# EAGLE schematic BodyCamBoardV1.1 (EAGLE 7.3.0)
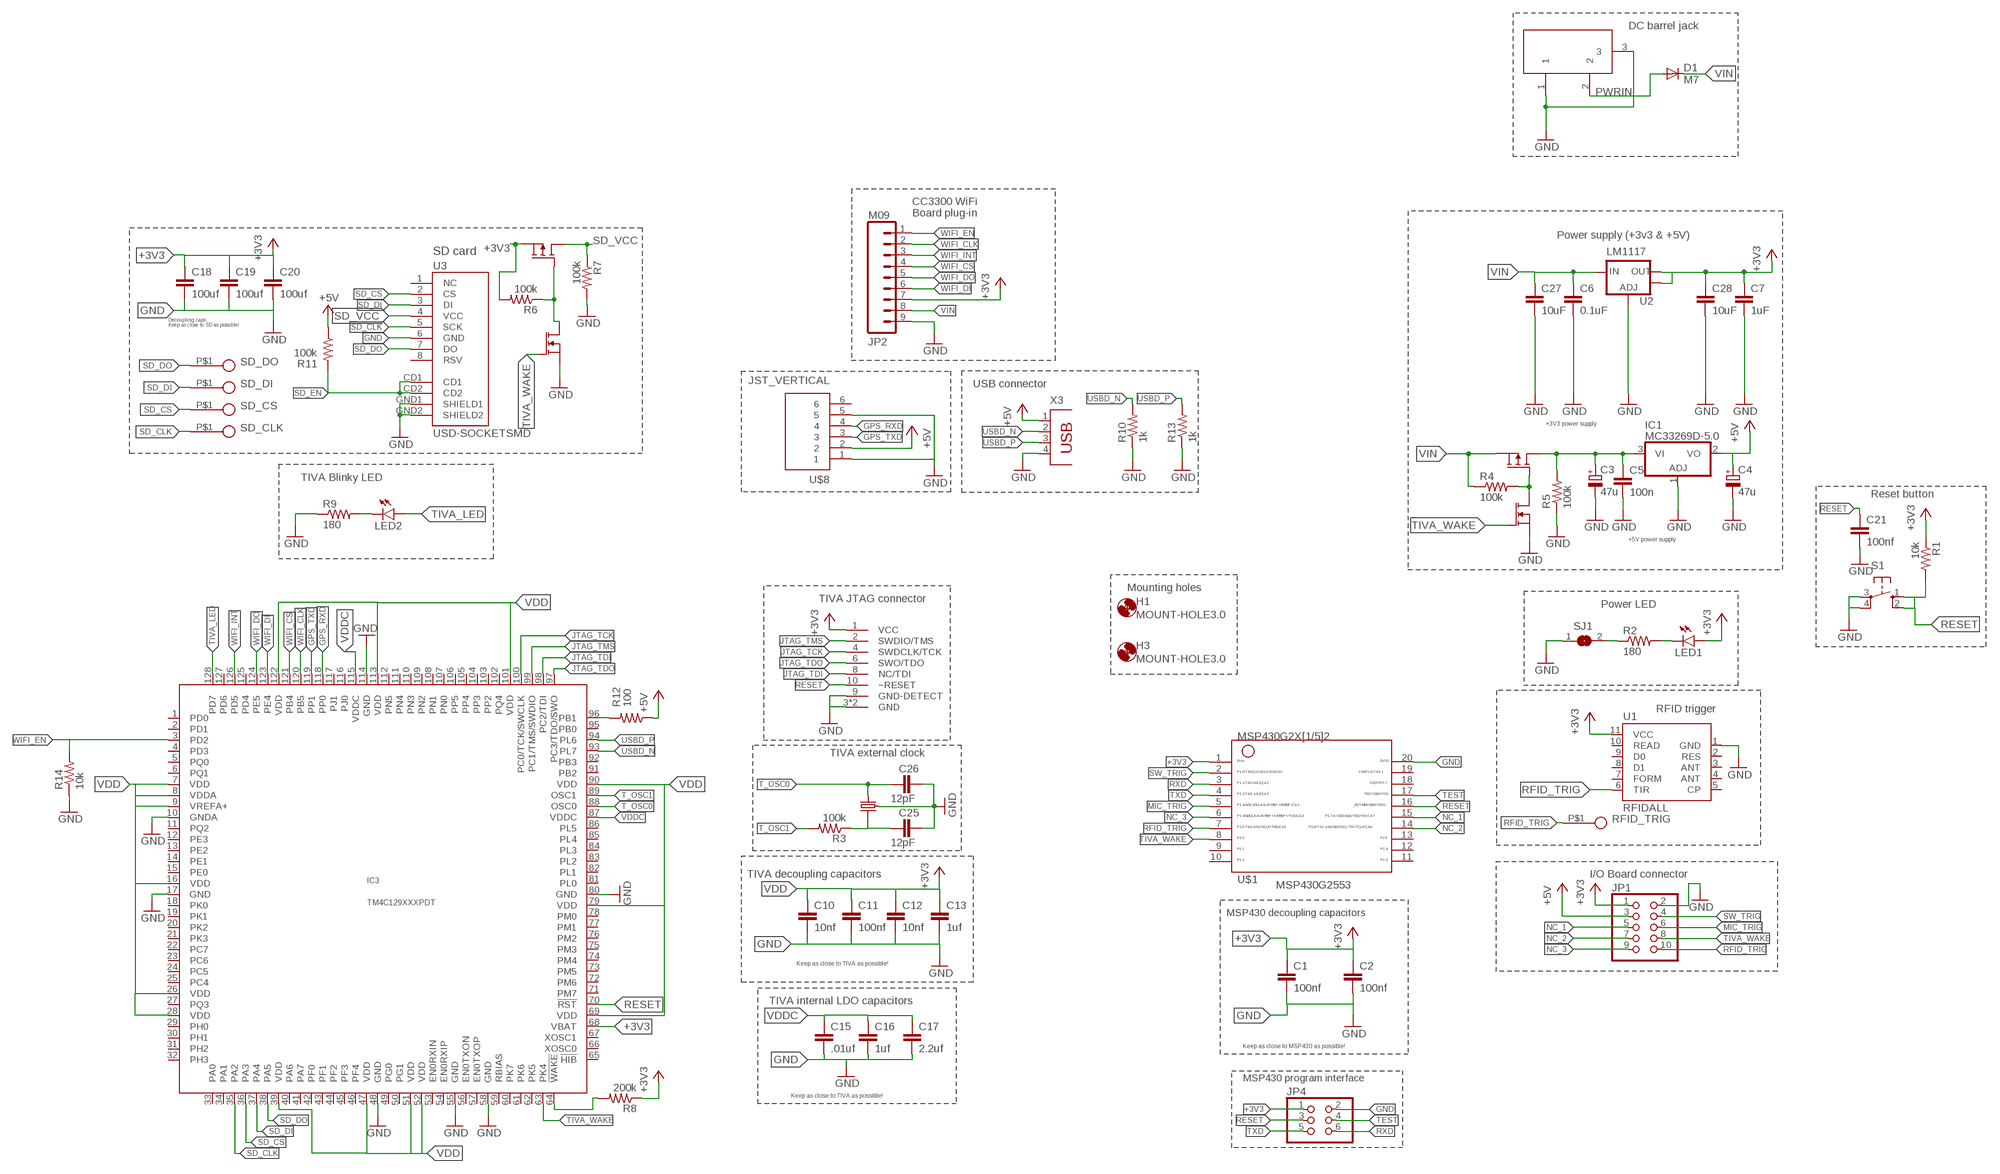
[diagram p0: schematic, sheet 1]

## Parts
C1  100nf  C-EUC0603  [C0603]
C2  100nf  C-EUC0603  [C0603]
C3  47u  CPOL-EUD  [PANASONIC_D]
C4  47u  CPOL-EUD  [PANASONIC_D]
C5  100n  C-EUC0603  [C0603]
C6  0.1uF  CAP0603-CAP  [0603-CAP]
C7  1uF  CAP0603-CAP  [0603-CAP]
C10  10nf  C-EUC0805  [C0805]
C11  100nf  C-EUC0805  [C0805]
C12  10nf  C-EUC0805  [C0805]
C13  1uf  C-EUC0805  [C0805]
C15  .01uf  C-EUC0805  [C0805]
C16  1uf  C-EUC0805  [C0805]
C17  2.2uf  C-EUC0805  [C0805]
C18  100uf  C-EUC1206  [C1206]
C19  100uf  C-EUC1206  [C1206]
C20  100uf  C-EUC1206  [C1206]
C21  100nf  C-EUC0603  [C0603]
C25  12pF  C-EUC0402  [C0402]
C26  12pF  C-EUC0402  [C0402]
C27  10uF  CAP0603-CAP  [0603-CAP]
C28  10uF  CAP0603-CAP  [0603-CAP]
D1  M7  DIODE-SMB  [SMB]
H1  MOUNT-HOLE3.0  [3,0]
H3  MOUNT-HOLE3.0  [3,0]
IC1  MC33269D-5.0  [DPACK]
IC3  TM4C129XXXPDT  [PDT_S-PQFP-G128]
JP1  PINHD-2X5  [2X05]
JP2  M09  [1X09]
JP4  PINHD-2X3  [2X03]
LED1  LED0603  [LED-0603@1]
LED2  LED0603  [LED-0603@1]
R1  10k  R-US_R0603  [R0603]
R2  180  R-US_R0603  [R0603]
R3  100k  R-US_R0402  [R0402]
R4  100k  R-US_R0603  [R0603]
R5  100k  R-US_R0603  [R0603]
R6  100k  R-US_R0603  [R0603]
R7  100k  R-US_R0603  [R0603]
R8  200k  R-US_R0603  [R0603]
R9  180  R-US_R0603  [R0603]
R10  1k  R-US_R0402  [R0402]
R11  100k  RESISTOR0603  [0603-RES]
R12  100  RESISTOR0603  [0603-RES]
R13  1k  R-US_R0402  [R0402]
R14  10k  R-US_R0603  [R0603]
RFID_TRIG  TEST_POINTSMD_MINI  [TEST_SMD_MINI_5019]
S1  10-XX  [B3F-10XX]
SD_CLK  TEST_POINTSMD_MINI  [TEST_SMD_MINI_5019]
SD_CS  TEST_POINTSMD_MINI  [TEST_SMD_MINI_5019]
SD_DI  TEST_POINTSMD_MINI  [TEST_SMD_MINI_5019]
SD_DO  TEST_POINTSMD_MINI  [TEST_SMD_MINI_5019]
SJ1  SJ  [SJ]
U1  RFIDALL  [ID_PACKAGE]
U2  LM1117  V_REG_LM1117SOT223  [SOT223]
U3  USD-SOCKETSMD  [MICRO-SD-SOCKET-PP]
U$1  G2X[1/5]2---PW20  [PW20]
U$2  STR2P3LLH6  [SOT-23]
U$3  25MHz  CRYSTAL_403C11E16  [4-SMD-SWITCH]
U$4  IRLML2402TRPBF  [SOT-23]
U$5  STR2P3LLH6  [SOT-23]
U$6  IRLML2402TRPBF  [SOT-23]
U$7  2X5_0.05"_CORTEX_DEBUGTH_KEYED_UNSHROUDED  [2X5_0.05"_TH_KEYED_NS]
U$8  JST_VERTICAL  [JST-6-SMD-VERT-1.0MM]
X2  DC21MMX  [DC-21MM]
X3  PN87520  [PN87520]

## Nets
+3V3: C1.1 C2.1 C7.1 C18.1 C19.1 C20.1 C28.1 IC3.68(VBAT) JP1.1 JP2.7 JP4.1 LED1.A R1.1 R6.2 R8.1 U1.11(VCC) U2.2(OUT) U2.4(OUT) U$1.1 U$5.2(S) U$7.1(VCC)
+5V: C4.+ IC1.2(VO) JP1.3 R11.1 R12.1 U$8.2 X3.1
GND: C1.2 C2.2 C3.- C4.- C5.2 C6.2 C7.2 C10.2 C11.2 C12.2 C13.2 C15.2 C16.2 C17.2 C18.2 C19.2 C20.2 C21.2 C25.2 C26.2 C27.2 C28.2 IC1.1(ADJ) IC3.10(GNDA) IC3.17(GND) IC3.48(GND) IC3.55(GND) IC3.58(GND) IC3.80(GND) IC3.114(GND) JP1.2 JP2.9 JP4.2 R5.1 R7.2 R10.1 R13.1 R14.1 S1.3(P) S1.4(P1) SJ1.1 U1.1(GND) U2.1(ADJ) U3.6(GND) U3.GND1(SHIELD1) U3.GND2(SHIELD2) U$1.20 U$3.2(GND) U$3.4(GND) U$4.2(S) U$6.2(S) U$7.3(GND) U$7.5(GND) U$7.9(GND-DETECT) U$8.1 U$8.5 X2.1 X2.3 X3.4
GPS_RXD: IC3.118(PP0) U$8.4
GPS_TXD: IC3.119(PP1) U$8.3
JTAG_TCK: IC3.100(PC0/TCK/SWCLK) U$7.4(SWDCLK/TCK)
JTAG_TDI: IC3.98(PC2/TDI) U$7.8(NC/TDI)
JTAG_TDO: IC3.97(PC3/TDO/SWO) U$7.6(SWO/TDO)
JTAG_TMS: IC3.99(PC1/TMS/SWDIO) U$7.2(SWDIO/TMS)
MIC_TRIG: JP1.6 U$1.5
N$1: LED1.C R2.2
N$2: R2.1 SJ1.2
N$3: R9.1
N$4: LED2.C R9.2
N$5: R4.2 U$2.1(G) U$4.3(D)
N$8: R3.2
N$9: C3.+ C5.1 IC1.3(VI) R5.2 U$2.3(D)
N$11: R6.1 U$5.1(G) U$6.3(D)
N$56: IC3.96(PB1) R12.2
NC_1: JP1.5 U$1.15
NC_2: JP1.7 U$1.14
NC_3: JP1.9 U$1.6
PWRIN: D1.A X2.2
RESET: C21.1 IC3.70(!RST) JP4.3 R1.2 S1.1(S) S1.2(S1) U$1.16 U$7.10(~RESET)
RFID_TRIG: JP1.10 RFID_TRIG.P$1 U1.6(TIR) U$1.7
RXD: JP4.6 U$1.3
SD_CLK: IC3.35(PA2) SD_CLK.P$1 U3.5(SCK)
SD_CS: IC3.36(PA3) SD_CS.P$1 U3.2(CS)
SD_DI: IC3.37(PA4) SD_DI.P$1 U3.3(DI)
SD_DO: IC3.38(PA5) SD_DO.P$1 U3.7(DO)
SD_EN: R11.2 U3.CD1 U3.CD2
SD_VCC: R7.1 U3.4(VCC) U$5.3(D)
SW_TRIG: JP1.4 U$1.2
T_OSC0: C26.1 IC3.88(OSC0) U$3.3
T_OSC1: C25.1 IC3.89(OSC1) R3.1 U$3.1
TEST: JP4.4 U$1.17
TIVA_LED: IC3.128(PD7) LED2.A
TIVA_WAKE: IC3.63(PK4) JP1.8 U$1.8 U$4.1(G) U$6.1(G)
TXD: JP4.5 U$1.4
USBD_N: IC3.93(PL7) R10.2 X3.2
USBD_P: IC3.94(PL6) R13.2 X3.3
VDD: C10.1 C11.1 C12.1 C13.1 IC3.7(VDD) IC3.8(VDDA) IC3.9(VREFA+) IC3.16(VDD) IC3.26(VDD) IC3.28(VDD) IC3.39(VDD) IC3.47(VDD) IC3.51(VDD) IC3.52(VDD) IC3.69(VDD) IC3.79(VDD) IC3.90(VDD) IC3.101(VDD) IC3.113(VDD) IC3.122(VDD) ; supply symbol labelled +3V3
VDDC: C15.1 C16.1 C17.1 IC3.87(VDDC) IC3.115(VDDC)
VIN: C6.1 C27.1 D1.C JP2.8 R4.1 U2.3(IN) U$2.2(S)
WAKE_SIG: IC3.64(!WAKE) R8.2
WIFI_CLK: IC3.120(PB5) JP2.2
WIFI_CS: IC3.121(PB4) JP2.4
WIFI_DI: IC3.123(PE4) JP2.6
WIFI_DO: IC3.124(PE5) JP2.5
WIFI_EN: IC3.3(PD2) JP2.1 R14.2
WIFI_INT: IC3.126(PD5) JP2.3
Unconnected: IC3.1(PD0) IC3.2(PD1) IC3.4(PD3) IC3.5(PQ0) IC3.6(PQ1) IC3.11(PQ2) IC3.12(PE3) IC3.13(PE2) IC3.14(PE1) IC3.15(PE0) IC3.18(PK0) IC3.19(PK1) IC3.20(PK2) IC3.21(PK3) IC3.22(PC7) IC3.23(PC6) IC3.24(PC5) IC3.25(PC4) IC3.27(PQ3) IC3.29(PH0) IC3.30(PH1) IC3.31(PH2) IC3.32(PH3) IC3.33(PA0) IC3.34(PA1) IC3.40(PA6) IC3.41(PA7) IC3.42(PF0) IC3.43(PF1) IC3.44(PF2) IC3.45(PF3) IC3.46(PF4) IC3.49(PG0) IC3.50(PG1) IC3.53(EN0RXIN) IC3.54(EN0RXIP) IC3.56(EN0TXON) IC3.57(EN0TXOP) IC3.59(RBIAS) IC3.60(PK7) IC3.61(PK6) IC3.62(PK5) IC3.65(!HIB) IC3.66(XOSC0) IC3.67(XOSC1) IC3.71(PM7) IC3.72(PM6) IC3.73(PM5) IC3.74(PM4) IC3.75(PM3) IC3.76(PM2) IC3.77(PM1) IC3.78(PM0) IC3.81(PL0) IC3.82(PL1) IC3.83(PL2) IC3.84(PL3) IC3.85(PL4) IC3.86(PL5) IC3.91(PB2) IC3.92(PB3) IC3.95(PB0) IC3.102(PQ4) IC3.103(PP2) IC3.104(PP3) IC3.105(PP4) IC3.106(PP5) IC3.107(PN0) IC3.108(PN1) IC3.109(PN2) IC3.110(PN3) IC3.111(PN4) IC3.112(PN5) IC3.116(PJ0) IC3.117(PJ1) IC3.125(PD4) IC3.127(PD6) U1.2(RES) U1.3(ANT) U1.4(ANT) U1.5(CP) U1.7(FORM) U1.8(D1) U1.9(D0) U1.10(READ) U3.1(NC) U3.8(RSV) U$1.9 U$1.10 U$1.11 U$1.12 U$1.13 U$1.18 U$1.19 U$8.6

## Notes on the sheet
- DC barrel jack
- CC3300 WiFi 
  Board plug-in
- Power supply (+3v3 & +5V)
- SD card
- Decoupling caps:
  Keep as close to SD as possible!
- USB connector
- +3V3 power supply
- TIVA Blinky LED
- Reset button
- +5V power supply
- Mounting holes
- TIVA JTAG connector
- Power LED
- RFID trigger
- TIVA external clock
- TIVA decoupling capacitors | I/O Board connector
- MSP430G2553
- MSP430 decoupling capacitors
- Keep as close to TIVA as possible!
- TIVA internal LDO capacitors
- Keep as close to MSP430 as possible!
- MSP430 program interface
- Keep as close to TIVA as possible!

## Library data of the parts
C1 C2 C5 C10-C13 C15-C21 C25 C26 = rcl:C-EU: CAPACITOR, European symbol
C3 C4 = rcl:CPOL-EU: POLARIZED CAPACITOR, European symbol
C6 C7 C27 C28 = SparkFun-Capacitors:CAP: Capacitor Standard 0603 ceramic capacitor, and 0.1" leaded capacitor.
D1 = diode:DIODE-: DIODE
H1 H3 = holes:MOUNT-HOLE: MOUNTING HOLE with drill center marker
IC1 = linear:MC33269?*: Adjustable Output Low Dropout Voltage Regulator 800 mA Source: http://www.onsemi.com/pub/Collateral/MC33269-D.PDF
IC3 = ti-tiva:TM4C129XXX
JP1 = pinhead:PINHD-2X5: PIN HEADER
JP2 = SparkFun-Connectors:M09: Header 9 Standard 9-pin 0.1" header. Use with straight break away headers (SKU : PRT-00116), right angle break away headers (PRT-00553), swiss pins (PRT-00743), machine pins (PRT-00117), and female headers (PRT-00115).
JP4 = pinhead:PINHD-2X3: PIN HEADER
LED1 LED2 = SparkFun-LED:LED: LEDs Standard schematic elements and footprints for 5mm, 3mm, 1206, and 0603 sized LEDs. 5mm - Spark Fun Electronics SKU : COM-00529 (and others)
R1 R2 R4-R9 R14 = resistor:R-US_: RESISTOR, American symbol
R3 R10 R13 = rcl:R-US_: RESISTOR, American symbol
R11 R12 = SparkFun-Resistors:RESISTOR: Resistor Basic schematic elements and footprints for 0603, 1206, and PTH resistors.
RFID_TRIG SD_CLK SD_CS SD_DI SD_DO = MAAV_Standard:TEST_POINT
S1 = switch-omron:10-XX: OMRON SWITCH; MPN: B3F-1000; OC_FARNELL: 176432; OC_NEWARK: 36M3542
SJ1 = jumper:SJ: SMD solder JUMPER
U1 = ID_Innovations:RFID
U2 = SparkFun-PowerIC:V_REG_LM1117: Voltage Regulator LM1117 Standard adjustable voltage regulator but in SMD form. Spark Fun Electronics SKU : COM-00595
U3 = AYYYYYYYYYYY:USD-SOCKET: microSD Socket Push-push type uSD socket. Schematic element and footprint production proven. Spark Fun Electronics SKU : PRT-00127. tDoc lines correctly indicate media card edge positions when inserting (unlocked, locked, depressed).
U$1 = TI_MSP430_v16:G2X[1/5]2---PW20: MSP430G2X[1/5]2 MSP430G2x52, MSP430G2x12 TSSOP (PW) 20 Pin Package http://focus.ti.com/docs/prod/folders/print/msp430g2452.html
U$2 U$5 = MOSFET:STR2P3LLH6
U$3 = imu:CRYSTAL_403C11E16; DIGIKEY: 403C11E16M00000
U$4 U$6 = MOSFET:IRLML2402TRPBF
U$7 = con-cortex:2X5_0.05"_CORTEX_DEBUG
U$8 = SparkFun-Connectors:JST_VERTICAL; PROD_ID: CONN-08249
X2 = powersupply:DC21MM
X3 = con-berg:PN87520: BERG USB connector; OC_FARNELL: unknown; OC_NEWARK: unknown